# EAGLE design md_builtin_game_v2.2_no_TMSS_bypass (EAGLE 7.5.0)
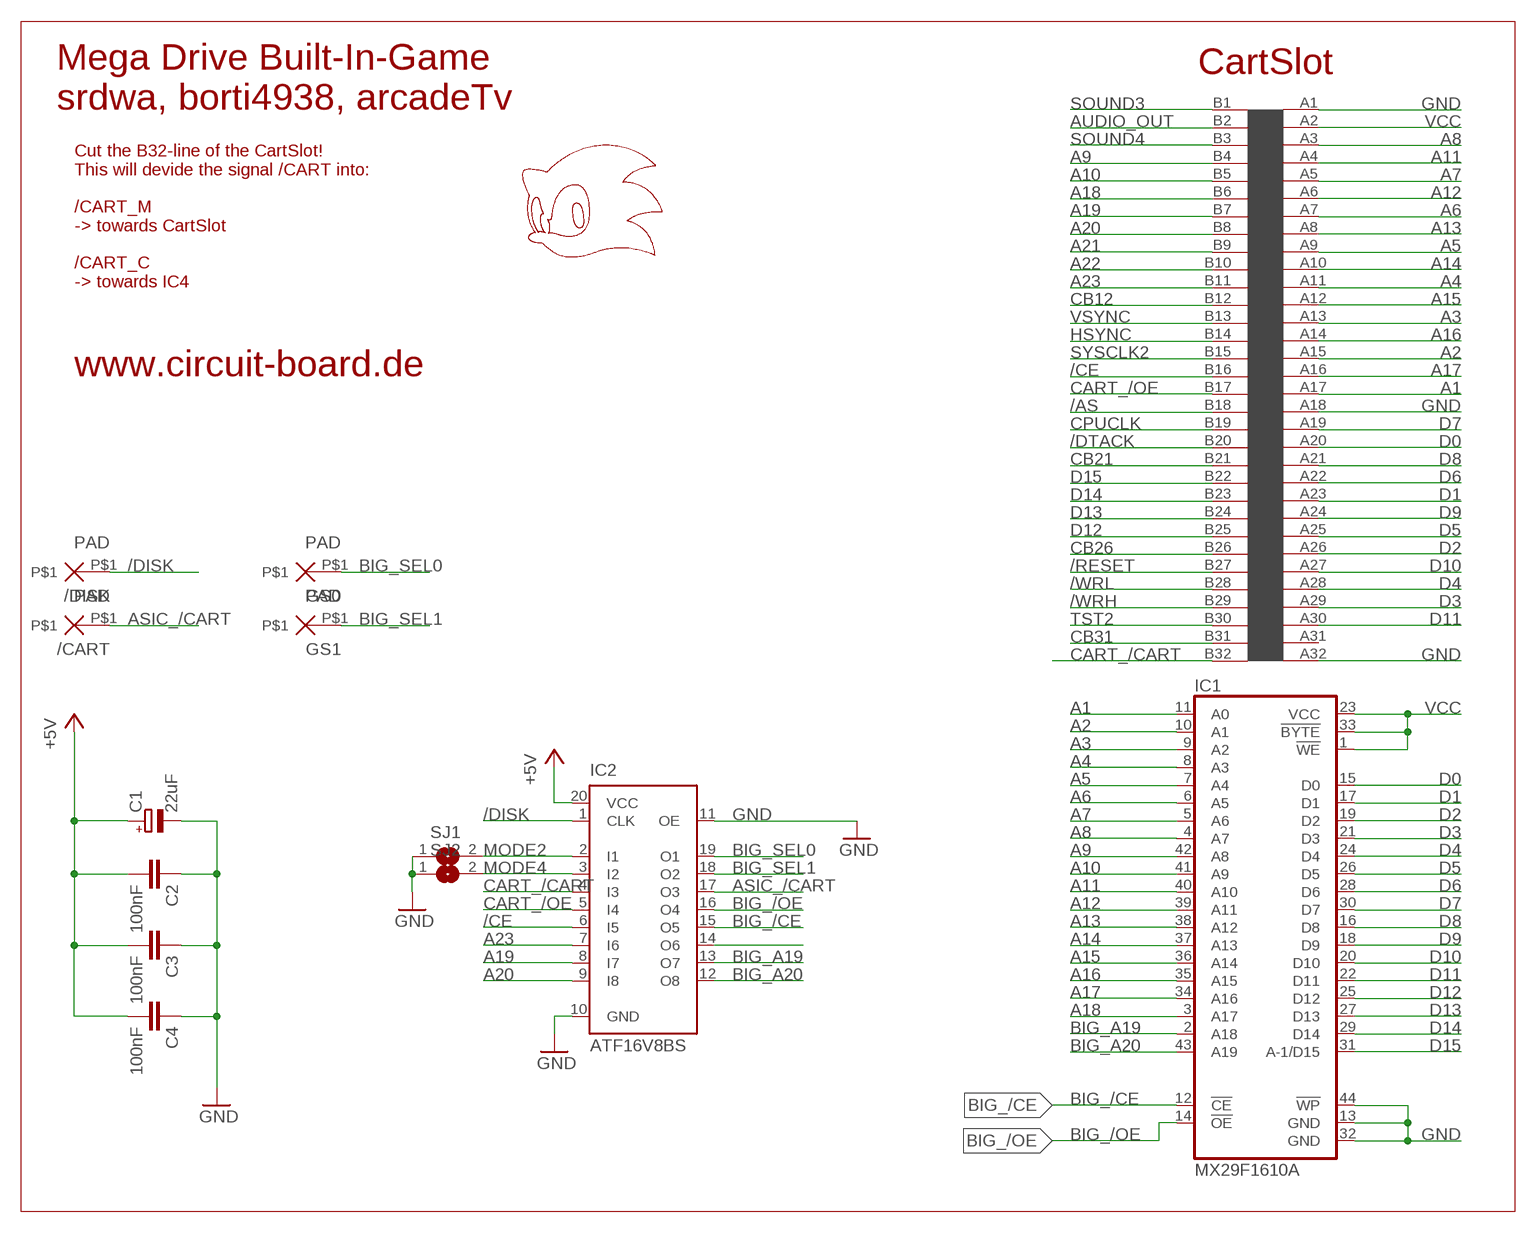
[diagram p0: schematic, sheet 1]

## Parts
/CART  PAD  [PADS]
/DISK  PAD  [PADS]
C1  22uF  CPOL-EUSMCC  [SMC_C]
C2  100nF  C0805  [Z0805]
C3  100nF  C0805  [Z0805]
C4  100nF  C0805  [Z0805]
GS0  PAD  [PADS]
GS1  PAD  [PADS]
IC1  MX29F1610A  [SO44]
IC2  ATF16V8BS  [SO20L]
SJ1  SJ  [SJ]
SJ2  SJ  [SJ]
U$1  LOGO_SONIC_20MM  [LOGO_SONIC_20MM]
U$6  MEGADRIVE_EDGE_CONNECTOR  [MEGADRIVE_EDGE_CONNECTOR]

## Nets
/AS: U$6.B18
/CE: IC2.6(I5) U$6.B16
/DISK: /DISK.P$1 IC2.1(CLK)
/DTACK: U$6.B20
/RESET: U$6.B27
/WRH: U$6.B29
/WRL: U$6.B28
A1: IC1.11(A0) U$6.A17
A2: IC1.10(A1) U$6.A15
A3: IC1.9(A2) U$6.A13
A4: IC1.8(A3) U$6.A11
A5: IC1.7(A4) U$6.A9
A6: IC1.6(A5) U$6.A7
A7: IC1.5(A6) U$6.A5
A8: IC1.4(A7) U$6.A3
A9: IC1.42(A8) U$6.B4
A10: IC1.41(A9) U$6.B5
A11: IC1.40(A10) U$6.A4
A12: IC1.39(A11) U$6.A6
A13: IC1.38(A12) U$6.A8
A14: IC1.37(A13) U$6.A10
A15: IC1.36(A14) U$6.A12
A16: IC1.35(A15) U$6.A14
A17: IC1.34(A16) U$6.A16
A18: IC1.3(A17) U$6.B6
A19: IC2.8(I7) U$6.B7
A20: IC2.9(I8) U$6.B8
A21: U$6.B9
A22: U$6.B10
A23: IC2.7(I6) U$6.B11
ASIC_/CART: /CART.P$1 IC2.17(O3)
AUDIO_OUT: U$6.B2
BIG_/CE: IC1.12(!CE) IC2.15(O5)
BIG_/OE: IC1.14(!OE) IC2.16(O4)
BIG_A19: IC1.2(A18) IC2.13(O7)
BIG_A20: IC1.43(A19) IC2.12(O8)
BIG_SEL0: GS0.P$1 IC2.19(O1)
BIG_SEL1: GS1.P$1 IC2.18(O2)
CART_/CART: IC2.4(I3) U$6.B32
CART_/OE: IC2.5(I4) U$6.B17
CB12: U$6.B12
CB21: U$6.B21
CB26: U$6.B26
CB31: U$6.B31
CPUCLK: U$6.B19
D0: IC1.15(D0) U$6.A20
D1: IC1.17(D1) U$6.A23
D2: IC1.19(D2) U$6.A26
D3: IC1.21(D3) U$6.A29
D4: IC1.24(D4) U$6.A28
D5: IC1.26(D5) U$6.A25
D6: IC1.28(D6) U$6.A22
D7: IC1.30(D7) U$6.A19
D8: IC1.16(D8) U$6.A21
D9: IC1.18(D9) U$6.A24
D10: IC1.20(D10) U$6.A27
D11: IC1.22(D11) U$6.A30
D12: IC1.25(D12) U$6.B25
D13: IC1.27(D13) U$6.B24
D14: IC1.29(D14) U$6.B23
D15: IC1.31(A-1/D15) U$6.B22
GND: C1.- C2.1 C3.1 C4.1 IC1.13(GND) IC1.32(GND) IC1.44(!WP) IC2.10(GND) IC2.11(OE) SJ1.1 SJ2.1 U$6.A1 U$6.A18 U$6.A32
HSYNC: U$6.B14
MODE2: IC2.2(I1) SJ1.2
MODE4: IC2.3(I2) SJ2.2
N$1: IC2.14(O6)
SOUND3: U$6.B1
SOUND4: U$6.B3
SYSCLK2: U$6.B15
TST2: U$6.B30
VCC: C1.+ C2.2 C3.2 C4.2 IC1.1(!WE) IC1.23(VCC) IC1.33(!BYTE) IC2.20(VCC) U$6.A2 ; supply symbol labelled +5V
VSYNC: U$6.B13
Unconnected: U$6.A31

## Notes on the sheet
- CartSlot
- Mega Drive Built-In-Game
  srdwa, borti4938, arcadeTv
- Cut the B32-line of the CartSlot!
  This will devide the signal /CART into:
  
  /CART_M
  -> towards CartSlot
  
  /CART_C
  -> towards IC4
- www.circuit-board.de

## Library data of the parts
/CART /DISK GS0 GS1 = snes_div:PAD
C1 = rcl:CPOL-EU: POLARIZED CAPACITOR, European symbol
C2-C4 = arcadetv:C0805
IC1 = arcadetv:MX29F1610A
IC2 = atmel:ATF16V8B: High perfomance CMOS (electrically erasable) programmable logic device (PLD) ABLE-Atmel-ABEL - P18V8R, P16V8C, P16V8AS, P17V8 COPL Atmel-WinCUPL - G16V8MS, G16V8MA, G16V8AS, G16V8 LOG/IC - GAL16V8_R, GAL16V8_G7, GAL16V8_C), GAL16V8 Tango-PLD - G16V8R, G16V8C, G16V8AS, G16V8 Source: http://www.atmel.com/dyn/resources/prod_documents/DOC0364.PDF; OC_FARNELL: unknown; OC_NEWARK: unknown
SJ1 SJ2 = jumper:SJ: SMD solder JUMPER
U$1 = arcadetv:LOGO_SONIC_20MM
U$6 = arcadetv:MEGADRIVE_EDGE_CONNECTOR

## Board
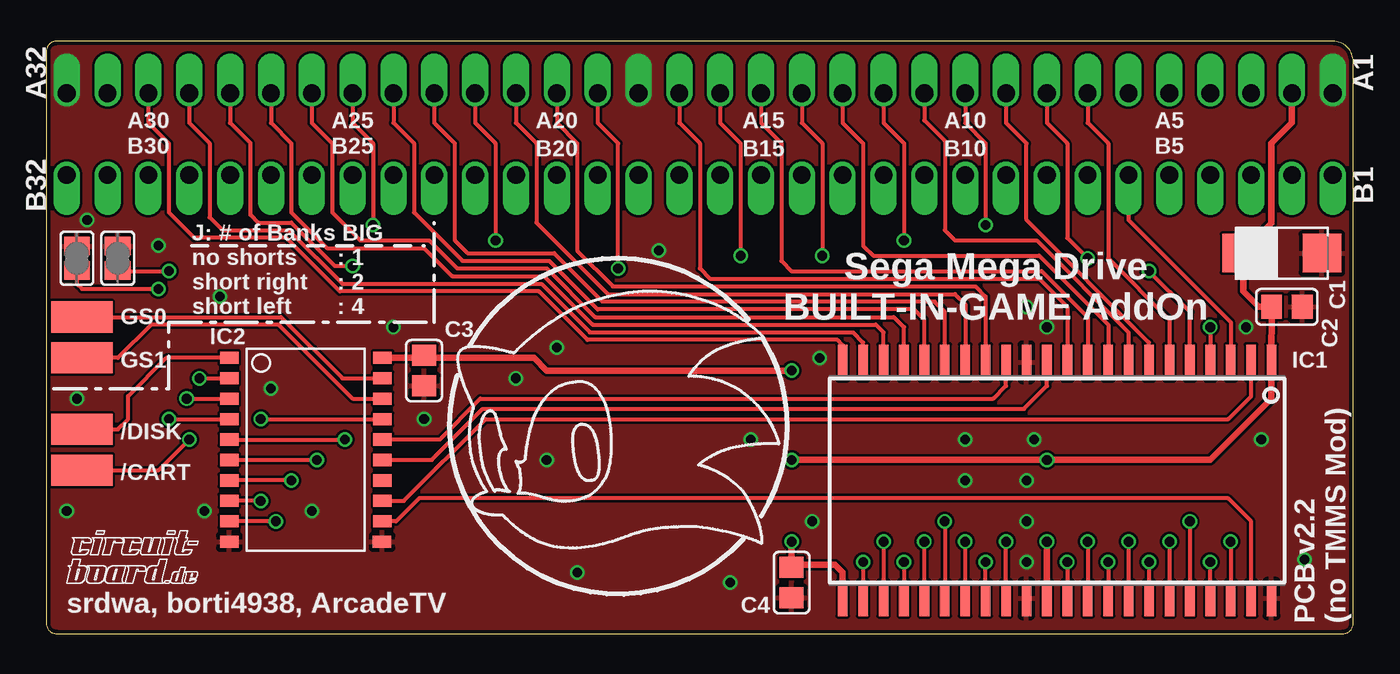
[diagram p1: board, top side]
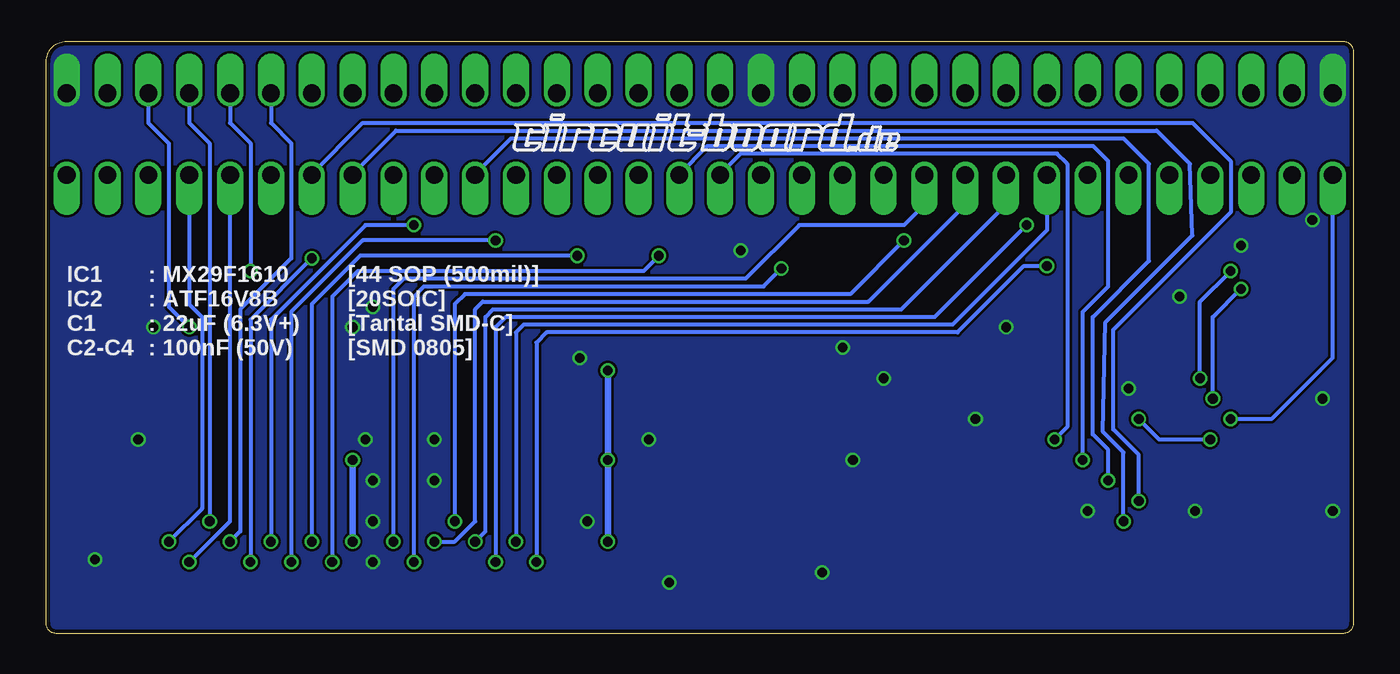
[diagram p2: board, bottom side, seen from below]

Size 81.28 x 36.83 mm. Coordinates in mm from the lower left corner, seen from the top.
Outline: 0.64,36.83 arc90 0,36.2 0,0.64 arc90 0.64,0 80.64,0 arc90 81.28,0.64 81.28,35.56 arc90 80.01,36.83 0.64,36.83
Copper layers (1*16): Top 0.035mm / dielectric 1.5mm / Bottom 0.035mm
Design rules "ITEADstudio_DRC": minimum track width 6mil, minimum drill 12mil, track to track 6mil, track to pad 6mil, pad to pad 6mil, via to via 6mil, smd to smd 0mil, copper to edge 10mil, drill to drill 10mil, minimum pad ring 10mil, minimum via ring 6mil, stop-mask expansion 2mil, vias tented up to drill 30mil, thermal gap 10mil

### Footprints (pad centres in the part's own frame; a part is rotated, then mirrored left to right if it is on the bottom)
PADS = smd 1.93 x 3.81: P$1 0,0
SMC_C = smd 2.4 x 2.4: + -2.5,0; - 2.5,0
Z0805 = smd 1.3 x 1.5: 1 -0.95,0; 2 0.95,0
SO44 = smd 0.6 x 2.2: 1 -13.335,-7.34; 2 -12.065,-7.34; 3 -10.795,-7.34; 4 -9.525,-7.34; 5 -8.255,-7.34; 6 -6.985,-7.34; 7 -5.715,-7.34; 8 -4.445,-7.34; 9 -3.175,-7.34; 10 -1.905,-7.34; 11 -0.635,-7.34; 12 0.635,-7.34; 13 1.905,-7.34; 14 3.175,-7.34; 15 4.445,-7.34; 16 5.715,-7.34; 17 6.985,-7.34; 18 8.255,-7.34; 19 9.525,-7.34; 20 10.795,-7.34; 21 12.065,-7.34; 22 13.335,-7.34; 23 13.335,7.34; 24 12.065,7.34; 25 10.795,7.34; 26 9.525,7.34; 27 8.255,7.34; 28 6.985,7.34; 29 5.715,7.34; 30 4.445,7.34; 31 3.175,7.34; 32 1.905,7.34; 33 0.635,7.34; 34 -0.635,7.34; 35 -1.905,7.34; 36 -3.175,7.34; 37 -4.445,7.34; 38 -5.715,7.34; 39 -6.985,7.34; 40 -8.255,7.34; 41 -9.525,7.34; 42 -10.795,7.34; 43 -12.065,7.34; 44 -13.335,7.34
SO20L = smd 0.762 x 1.143: 1 -5.08,-5.131; 2 -3.81,-5.131; 3 -2.54,-5.131; 4 -1.27,-5.131; 5 0,-5.131; 6 1.27,-5.131; 7 2.54,-5.131; 8 3.81,-5.131; 9 5.08,-5.131; 10 6.35,-5.131; 11 6.35,4.369; 12 5.08,4.394; 13 3.81,4.394; 14 2.54,4.394; 15 1.27,4.394; 16 0,4.394; 17 -1.27,4.394; 18 -2.54,4.394; 19 -3.81,4.394; 20 -5.08,4.394
SJ = smd 1.168 x 1.6: 1 -0.762,0; 2 0.762,0
MEGADRIVE_EDGE_CONNECTOR = drill 1.1 offset: A1 39.37,2.54; A2 36.83,2.54; A3 34.29,2.54; A4 31.75,2.54; A5 29.21,2.54; A6 26.67,2.54; A7 24.13,2.54; A8 21.59,2.54; A9 19.05,2.54; A10 16.51,2.54; A11 13.97,2.54; A12 11.43,2.54; A13 8.89,2.54; A14 6.35,2.54; A15 3.81,2.54; A16 1.27,2.54; A17 -1.27,2.54; A18 -3.81,2.54; A19 -6.35,2.54; A20 -8.89,2.54; A21 -11.43,2.54; A22 -13.97,2.54; A23 -16.51,2.54; A24 -19.05,2.54; A25 -21.59,2.54; A26 -24.13,2.54; A27 -26.67,2.54; A28 -29.21,2.54; A29 -31.75,2.54; A30 -34.29,2.54; A31 -36.83,2.54; A32 -39.37,2.54; B1 39.37,-2.54; B2 36.83,-2.54; B3 34.29,-2.54; B4 31.75,-2.54; B5 29.21,-2.54; B6 26.67,-2.54; B7 24.13,-2.54; B8 21.59,-2.54; B9 19.05,-2.54; B10 16.51,-2.54; B11 13.97,-2.54; B12 11.43,-2.54; B13 8.89,-2.54; B14 6.35,-2.54; B15 3.81,-2.54; B16 1.27,-2.54; B17 -1.27,-2.54; B18 -3.81,-2.54; B19 -6.35,-2.54; B20 -8.89,-2.54; B21 -11.43,-2.54; B22 -13.97,-2.54; B23 -16.51,-2.54; B24 -19.05,-2.54; B25 -21.59,-2.54; B26 -24.13,-2.54; B27 -26.67,-2.54; B28 -29.21,-2.54; B29 -31.75,-2.54; B30 -34.29,-2.54; B31 -36.83,-2.54; B32 -39.37,-2.54

### Placement (x,y rotation side)
/CART  2.22,10.16 90 top
/DISK  2.22,12.7 90 top
C1  76.83,23.65 0 top
C2  77.15,20.32 180 top
C3  23.5,16.35 90 top
C4  46.35,3.17 90 top
GS0  2.22,19.68 90 top
GS1  2.22,17.14 90 top
IC1  62.87,9.53 180 top
IC2  16.51,12.06 270 top
SJ1  4.45,23.34 270 top
SJ2  1.91,23.34 270 top
U$1  25.08,23.81 0 top
U$6  40.64,31.05 0 top

### Tracks (layer width: path | path; a pad name or v marks a point on that pad's centre or on a via)
/CE  (via drill 0.6)
  Top 0.254: IC2.6 v16.83,10.79
  Bottom 0.254: U$6.B16 41.91,28.57 40.16,30.32 16.19,30.32 15.24,29.37 15.24,21.59 16.83,20 v16.83,10.79
/DISK
  Top 0.254: IC2.1 7.46,17.14 5.08,14.76 5.08,13.34 4.45,12.7 /DISK.P$1
A1
  Top 0.254: U$6.A17 39.37,31.75 40.64,30.48 40.64,22.7 41.27,22.07 61.75,22.07 63.5,20.32 IC1.11
A2
  Top 0.254: U$6.A15 44.45,31.75 45.72,30.48 45.72,23.18 46.35,22.54 61.91,22.54 64.77,19.68 IC1.10
A3
  Top 0.254: U$6.A13 49.53,31.75 50.8,30.48 50.8,24.13 51.44,23.5 61.75,23.5 66.04,19.21 IC1.9
A4
  Top 0.254: U$6.A11 54.61,31.91 55.88,30.64 55.88,25.08 56.52,24.45 61.59,24.45 67.31,18.73 IC1.8
A5
  Top 0.254: U$6.A9 59.69,31.75 60.96,30.48 60.96,25.72 68.58,18.1 IC1.7
A6
  Top 0.254: U$6.A7 64.77,31.75 66.04,30.48 66.04,23.34 69.85,19.53 IC1.6
A7  (via drill 0.6)
  Top 0.254: IC1.5 71.12,20 v68.58,22.54
  Bottom 0.254: U$6.A5 69.85,31.75 68.58,30.48 v68.58,22.54
A8  (via drill 0.6)
  Top 0.254: v72.39,19.05 IC1.4
  Bottom 0.254: U$6.A3 74.93,31.75 73.66,30.48 73.66,20.32 v72.39,19.05
A9  (via drill 0.6)
  Top 0.254: v73.66,5.71 IC1.42
  Bottom 0.254: U$6.B4 72.39,20.48 71.6,19.68 71.6,7.78 v73.66,5.71
A10  (via drill 0.6)
  Top 0.254: IC1.41 v72.39,4.45
  Bottom 0.254: v72.39,4.45 69.85,6.99 U$6.B5
A11  (via drill 0.6)
  Top 0.254: v71.12,6.99 IC1.40
  Bottom 0.254: U$6.A4 72.39,31.75 71.12,30.48 v71.12,6.99
A12  (via drill 0.6)
  Top 0.254: v69.85,5.71 IC1.39
  Bottom 0.254: U$6.A6 67.31,31.75 66.04,30.48 66.04,23.34 69.22,20.16 69.22,6.35 v69.85,5.71
A13  (via drill 0.6)
  Top 0.254: U$6.A8 62.23,31.75 63.5,30.48 63.5,24.61 v64.77,23.34 | v68.58,4.45 IC1.38
  Bottom 0.254: v64.77,23.34 68.58,19.53 v68.58,4.45
A14  (via drill 0.6)
  Top 0.254: U$6.A10 57.15,31.75 58.42,30.48 v58.42,25.4 | v67.31,5.71 IC1.37
  Bottom 0.254: v58.42,25.4 61.44,25.4 67.31,19.53 v67.31,5.71
A15  (via drill 0.6)
  Top 0.254: U$6.A12 52.07,31.75 53.34,30.48 v53.34,24.45 | v66.04,4.45 IC1.36
  Bottom 0.254: v53.34,24.45 61.59,24.45 66.04,20 v66.04,4.45
A16  (via drill 0.6)
  Top 0.254: U$6.A14 46.99,31.75 48.26,30.48 v48.26,23.5 | v64.77,5.71 IC1.35
  Bottom 0.254: v48.26,23.5 61.75,23.5 64.77,20.48 v64.77,5.71
A17  (via drill 0.6)
  Top 0.254: U$6.A16 41.91,31.75 43.18,30.48 v43.18,23.5 | v63.5,4.45 IC1.34
  Bottom 0.254: v43.18,23.5 44.13,22.54 61.91,22.54 63.5,20.95 v63.5,4.45
A18
  Top 0.254: U$6.B6 67.31,25.72 73.66,19.37 IC1.3
A19  (via drill 0.6)
  Top 0.254: v13.34,8.26 IC2.8
  Bottom 0.254: U$6.B7 64.77,28.57 61.59,31.75 10,31.75 7.62,29.37 7.62,26.19 14.92,18.89 14.92,12.7 13.34,11.11 v13.34,8.26
A20  (via drill 0.6)
  Top 0.254: v14.29,6.99 IC2.9
  Bottom 0.254: U$6.B8 62.23,28.57 59.53,31.27 12.22,31.27 10.16,29.21 10,24.77 15.4,19.37 15.56,12.54 14.29,11.27 v14.29,6.99
A23  (via drill 0.6)
  Top 0.254: v15.24,9.53 IC2.7
  Bottom 0.254: U$6.B11 54.61,28.57 52.39,30.8 14.29,30.8 12.7,29.21 12.7,23.18 16.19,19.68 16.19,12.38 15.24,11.43 v15.24,9.53
ASIC_/CART  (via drill 0.6)
  Top 0.254: v13.34,13.34 IC2.17 | /CART.P$1 6.99,10.16 v8.89,12.06
  Bottom 0.254: v8.89,12.06 12.06,12.06 v13.34,13.34
BIG_/CE
  Top 0.254: IC1.12 62.23,15.4 60.8,13.97 27.15,13.97 23.97,10.79 IC2.15
BIG_/OE
  Top 0.254: IC1.14 59.69,15.4 58.9,14.61 26.99,14.61 24.45,12.06 IC2.16
BIG_A19
  Top 0.254: IC2.13 22.23,8.26 27.3,13.34 73.5,13.34 74.93,14.76 IC1.2
BIG_A20
  Top 0.254: IC1.43 74.93,6.99 73.5,8.41 23.18,8.41 21.75,6.99 IC2.12
BIG_SEL0
  Top 0.254: IC2.19 18.41,15.88 14.61,19.68 GS0.P$1
BIG_SEL1
  Top 0.254: IC2.18 19.05,14.61 14.45,19.21 6.51,19.21 4.45,17.14 GS1.P$1 3.81,17.14
CART_/CART  (via drill 0.6)
  Top 0.254: v7.62,13.34 IC2.4
  Bottom 0.254: U$6.B32 1.27,17.14 5.08,13.34 v7.62,13.34
CART_/OE  (via drill 0.6)
  Top 0.254: IC2.5 v18.57,12.06
  Bottom 0.254: U$6.B17 39.37,28.57 38.1,29.84 18.41,29.84 17.78,29.21 17.78,12.86 v18.57,12.06
D0
  Top 0.254: U$6.A20 31.75,31.75 33.02,30.48 33.02,23.81 35.24,21.59 57.78,21.59 58.42,20.95 IC1.15
D1
  Top 0.254: U$6.A23 24.13,31.75 25.4,30.48 25.4,24.45 26.19,23.65 31.59,23.65 34.61,20.64 55.24,20.64 55.88,20 IC1.17
D2
  Top 0.254: U$6.A26 16.51,31.75 17.78,30.48 17.78,26.19 19.53,24.45 23.81,24.45 25.56,22.7 31.11,22.7 34.13,19.68 52.7,19.68 53.34,19.05 IC1.19
D3
  Top 0.254: U$6.A29 8.89,31.75 10.16,30.48 10.16,25.88 10.95,25.08 15.08,25.08 18.41,21.75 30.8,21.75 33.81,18.73 50.16,18.73 50.8,18.1 IC1.21
D4  (via drill 0.6)
  Top 0.254: U$6.A28 11.43,31.75 12.7,30.48 12.7,26.04 13.18,25.56 15.24,25.56 17.94,22.86 v19.05,22.86 | v50.8,4.45 IC1.24
  Bottom 0.254: v50.8,4.45 50.8,18.1 50.16,18.73 24.61,18.73 20.48,22.86 v19.05,22.86
D5  (via drill 0.6)
  Top 0.254: U$6.A25 19.05,31.75 20.32,30.48 v20.32,25.4 | v53.34,4.45 IC1.26
  Bottom 0.254: v53.34,4.45 53.34,19.05 52.7,19.68 26.04,19.68 v20.32,25.4
D6  (via drill 0.6)
  Top 0.254: U$6.A22 26.67,31.75 27.94,30.48 v27.94,24.45 | v55.88,6.99 IC1.28
  Bottom 0.254: v27.94,24.45 31.27,21.11 55.24,21.11 55.88,20.48 v55.88,6.99
D7  (via drill 0.6)
  Top 0.254: U$6.A19 34.29,31.75 35.56,30.48 v35.56,22.7 | IC1.30 v58.42,4.45
  Bottom 0.254: v58.42,4.45 58.42,20.95 57.78,21.59 36.67,21.59 v35.56,22.7
D8
  Top 0.254: U$6.A21 29.21,31.75 30.48,30.48 30.48,25.56 34.92,21.11 56.52,21.11 57.15,20.48 IC1.16
D9
  Top 0.254: U$6.A24 21.59,31.75 22.86,30.48 22.86,26.19 25.88,23.18 31.27,23.18 34.29,20.16 53.98,20.16 54.61,19.53 IC1.18
D10
  Top 0.254: U$6.A27 13.97,31.75 15.24,30.48 15.24,26.19 17.46,23.97 23.5,23.97 25.24,22.23 30.96,22.23 33.97,19.21 51.59,19.21 52.07,18.73 IC1.20
D11
  Top 0.254: U$6.A30 6.35,31.75 7.62,30.48 7.62,26.19 9.21,24.61 14.92,24.61 18.26,21.27 30.64,21.27 33.66,18.26 49.21,18.26 49.53,17.94 IC1.22
D12  (via drill 0.6)
  Top 0.254: v52.07,5.71 IC1.25
  Bottom 0.254: U$6.B25 19.05,25.08 24.92,19.21 51.59,19.21 52.07,18.73 v52.07,5.71
D13  (via drill 0.6)
  Top 0.254: IC1.27 v54.61,5.71
  Bottom 0.254: U$6.B24 21.59,26.67 28.1,20.16 53.5,20.16 53.98,19.68 53.98,6.35 v54.61,5.71
D14  (via drill 0.6)
  Top 0.254: IC1.29 v57.15,5.71
  Bottom 0.254: U$6.B23 24.13,26.67 30.16,20.64 54.13,20.64 54.61,20.16 54.61,6.99 55.88,5.71 v57.15,5.71
D15  (via drill 0.6)
  Top 0.254: IC1.31 v59.69,5.71
  Bottom 0.254: v59.69,5.71 59.69,21.43 59.05,22.07 37.78,22.07 34.45,25.4 27.94,25.4 26.67,26.67 U$6.B22
GND  (via drill 0.6)
  other vias: 60.96,4.45 60.96,9.53 61.44,12.06 60.96,20.32 62.23,19.05 38.1,23.81 42.55,3.17 13.97,15.24 9.84,7.62 31.11,10.79 33.02,3.81 75.56,12.06 57.15,12.06 48.1,17.14 43.81,12.06 31.75,17.78 6.99,24.13 2.54,25.72 10.79,20.95 23.5,13.34 21.59,19.05 16.51,7.62 78.26,4.6 57.15,9.53 47.62,6.99 29.21,15.88 1.27,7.62 60.96,6.99 74.61,19.05 1.91,14.61
  pour Bottom: 0,38.1 82.55,38.1 82.55,0 0,0
  pour Top (rank 6): 0,38.1 82.55,38.1 82.55,0 0,0
  pour Top (no thermals): 35.56,36.83 38.1,36.83 38.1,31.75 35.56,31.75
  pour Bottom (no thermals): 35.56,36.83 38.1,36.83 38.1,31.75 35.56,31.75
  pour Bottom (no thermals): 0,36.83 2.54,36.83 2.54,32.7 0,32.7
  pour Bottom (no thermals): 78.74,36.83 81.28,36.83 81.28,32.7 78.74,32.7
  pour Top (no thermals): 0,36.83 2.54,36.83 2.54,32.7 0,32.7
  pour Top (no thermals): 78.74,36.83 81.28,36.83 81.28,32.7 78.74,32.7
MODE2  (via drill 0.6)
  Top 0.254: SJ1.2 3.81,22.54 v7.62,22.54 | v9.53,15.88 IC2.2
  Bottom 0.254: v9.53,15.88 9.53,20.64 v7.62,22.54
MODE4  (via drill 0.6)
  Top 0.254: SJ2.2 1.91,21.75 2.22,21.43 v6.99,21.43 | v8.73,14.61 IC2.3
  Bottom 0.254: v8.73,14.61 8.73,19.68 v6.99,21.43
VCC  (via drill 0.6)
  Top 0.406: IC1.33 v62.23,5.71 | v46.35,10.79 v62.23,10.79 72.39,10.79 76.2,14.61 IC1.1 C2.2 75.41,20.32 74.45,21.27 74.45,23.54 C1.+ 76.2,25.52 76.2,30.48 77.47,31.75 U$6.A2 | IC2.20 22.86,17.14 | 22.86,17.14 30.32,17.14 31.11,16.35 v46.35,16.35 | C3.2 23.02,17.3 22.86,17.14 | v46.35,5.71 C4.2 46.52,4.29 49.05,4.29 49.53,3.81 IC1.23
  Bottom 0.406: v62.23,5.71 v62.23,10.79 | v46.35,5.71 v46.35,10.79 v46.35,16.35

### Text on the board
tPlace: A30 | A25 | A20 | A15 | A10 | A5 | B30 | B25 | B20 | B15 | B10 | B5 | srdwa, borti4938, ArcadeTV | PCB v2.2 / (no TMMS Mod)
tNames: Sega Mega Drive / BUILT-IN-GAME AddOn | J: # of Banks BIG / no shorts / short right / short left | : 1 / : 2 / : 4 | GS0 | GS1 | /DISK | /CART
bNames: [44 SOP (500mil)] / [20SOIC] / [Tantal SMD-C] / [SMD 0805] | : MX29F1610 / : ATF16V8B / : 22uF (6.3V+) / : 100nF (50V) | IC1 / IC2 / C1 / C2-C4